# Altium schematic sheet ADS1257.SchDoc
size A4
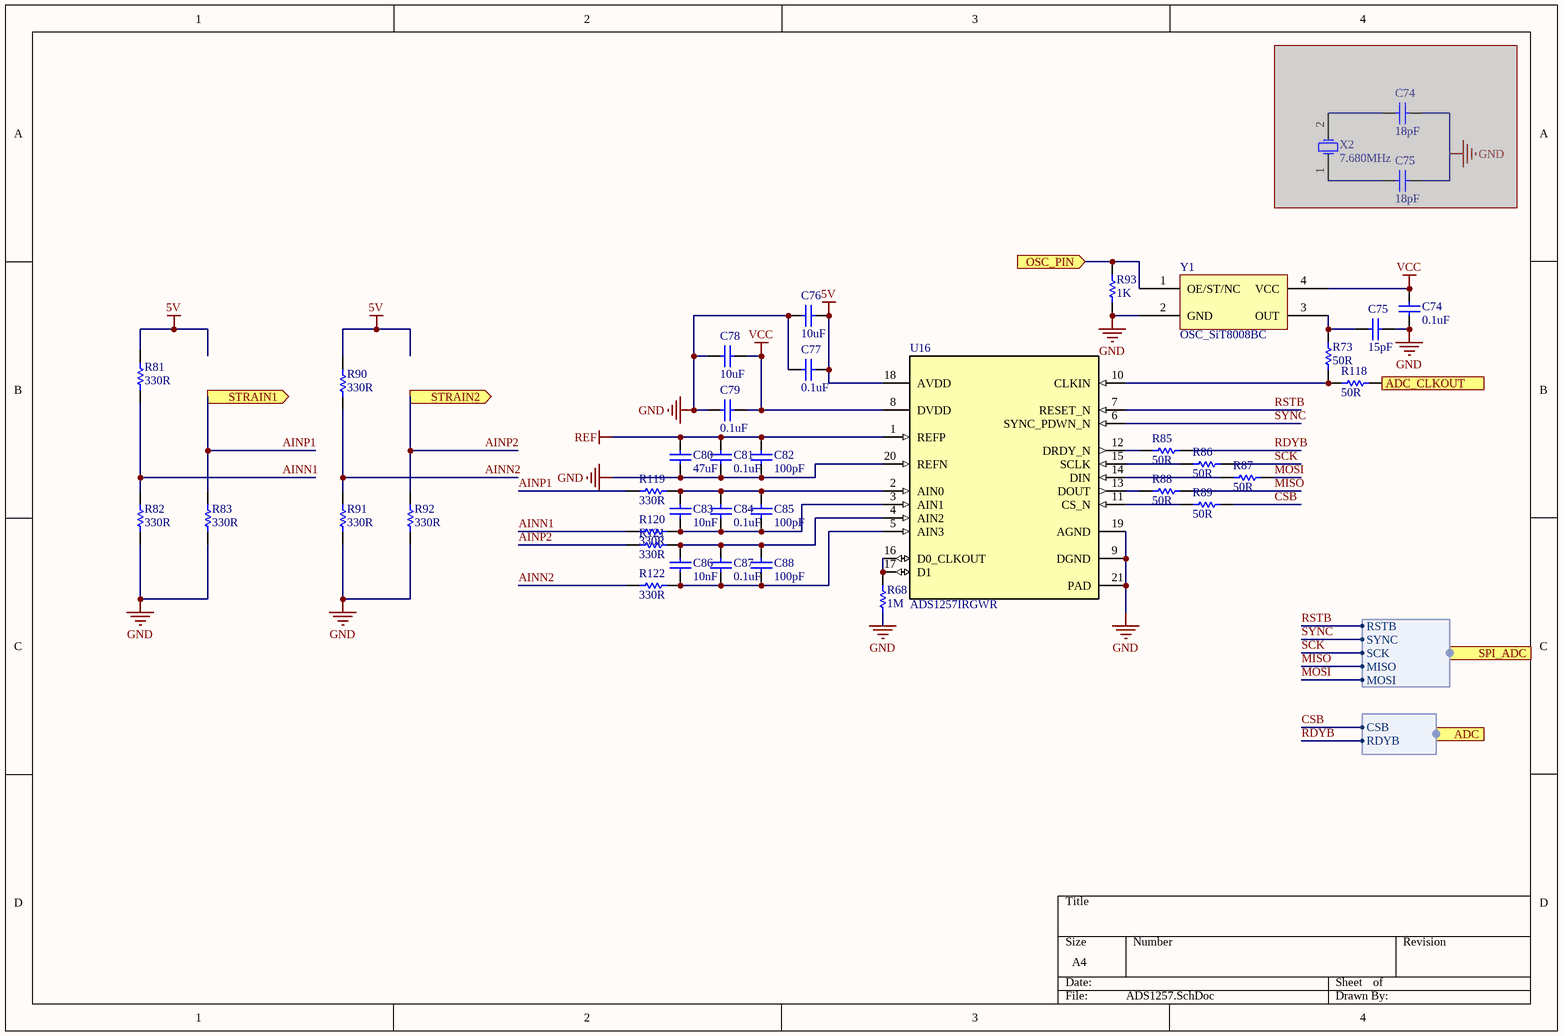
[diagram p0: ADS1257.SchDoc]

## Parts
(Parts that share a designator on the sheet are numbered #1, #2 ... from top to bottom, then left to right.)
C74#1  value 18pF  [C0603[1608X92]]  (hidden comment: 18pF 50V 0603)  (masked out: inside a compile mask, not in the netlist)
C74#2  value 0.1uF  [C0603[1608X92]]  (hidden comment: 0.1uF 16V 0603)
C75#1  value 18pF  [C0603[1608X92]]  (hidden comment: 18pF 50V 0603)  (masked out: inside a compile mask, not in the netlist)
C75#2  value 15pF  [C0603[1608X92]]  (hidden comment: 15pF 50V 0603)
C76  value 10uF  [C0603[1608X92]]  (hidden comment: 10uF 16V 0603)
C77  value 0.1uF  [C0603[1608X92]]  (hidden comment: 0.1uF 16V 0603)
C78  value 10uF  [C0603[1608X92]]  (hidden comment: 10uF 6.3V 0603)
C79  value 0.1uF  [C0603[1608X92]]  (hidden comment: 0.1uF 6.3V 0603)
C80  value 47uF  [C1206[3216X160]]  (hidden comment: 47uF 10V 1206)
C81  value 0.1uF  [C1206[3216X160]]  (hidden comment: 0.1uF 10V 1206)
C82  value 100pF  [C0603[1608X92]]  (hidden comment: 100pF 10V 0603)
C83  value 10nF  [C0805[2012X120]]  (hidden comment: 1uF)
C84  value 0.1uF  [C1206[3216X160]]  (hidden comment: 0.1uF 10V 1206)
C85  value 100pF  [C0603[1608X92]]  (hidden comment: 100pF 10V 0603)
C86  value 10nF  [C0805[2012X120]]  (hidden comment: 1uF)
C87  value 0.1uF  [C1206[3216X160]]  (hidden comment: 0.1uF 10V 1206)
C88  value 100pF  [C0603[1608X92]]  (hidden comment: 100pF 10V 0603)
R68  value 1M  [R0603[1608]]  (hidden comment: 1M 5% 0603)
R73  value 50R  [R0603[1608]]  (hidden comment: 50R 1% 0603)
R81  value 330R  [R0603[1608]]  (hidden comment: 330R 0.1% 0603)
R82  value 330R  [R0603[1608]]  (hidden comment: 330R 0.1% 0603)
R83  value 330R  [R0603[1608]]  (hidden comment: 330R 0.1% 0603)
R85  value 50R  [R0603[1608]]  (hidden comment: 50R 1% 0603)
R86  value 50R  [R0603[1608]]  (hidden comment: 50R 1% 0603)
R87  value 50R  [R0603[1608]]  (hidden comment: 50R 1% 0603)
R88  value 50R  [R0603[1608]]  (hidden comment: 50R 1% 0603)
R89  value 50R  [R0603[1608]]  (hidden comment: 50R 1% 0603)
R90  value 330R  [R0603[1608]]  (hidden comment: 330R 0.1% 0603)
R91  value 330R  [R0603[1608]]  (hidden comment: 330R 0.1% 0603)
R92  value 330R  [R0603[1608]]  (hidden comment: 330R 0.1% 0603)
R93  value 1K  [R0603[1608]]  (hidden comment: 1K 1% 0603)
R118  value 50R  [R0603[1608]]  (hidden comment: 50R 1% 0603)
R119  value 330R  [R0603[1608]]  (hidden comment: 330R 0.1% 0603)
R120  value 330R  [R0603[1608]]  (hidden comment: 330R 0.1% 0603)
R121  value 330R  [R0603[1608]]  (hidden comment: 330R 0.1% 0603)
R122  value 330R  [R0603[1608]]  (hidden comment: 330R 0.1% 0603)
U16  ADS1257IRGWR  [VQFN-20/RGW]
X2  7.680MHz  [OSC_HCN49]  (masked out: inside a compile mask, not in the netlist)
Y1  OSC_SiT8008BC  [OSC_4P_3R2x2R5]

## Ports
ADC (harness ADC), ADC_CLKOUT (in), OSC_PIN (in), SPI_ADC (harness SPI_ADC), STRAIN1 (out), STRAIN2 (out)

## Harnesses
SPI_ADC: MOSI, MISO, SCK, SYNC, RSTB
ADC: CSB, RDYB

## Nets
5V: C76.1 C77.1 R81.2 R90.2 U16.18(AVDD)
GND: C74#2.2 C75#2.1 C76.2 C77.2 C78.2 C79.2 C80.2 C81.2 C82.2 R68.2 R82.1 R83.1 R91.1 R92.1 R93.2 U16.9(DGND) U16.19(AGND) U16.20(REFN) U16.21(PAD) Y1.2(GND)
REF: C80.1 C81.1 C82.1 U16.1(REFP)
VCC: C74#2.1 C78.1 C79.1 U16.8(DVDD) Y1.4(VCC)
ADC_CLKOUT: R118.1 ; port ADC_CLKOUT
AINN1: R81.1 R82.2 R120.2
AINN2: R90.1 R91.2 R122.2
AINP1: R83.2 R119.2 ; port STRAIN1
AINP2: R92.2 R121.2 ; port STRAIN2
CSB: R89.2 ; port ADC.CSB
MISO: R88.2 ; port SPI_ADC.MISO
MOSI: R87.2 ; port SPI_ADC.MOSI
OSC_PIN: R93.1 Y1.1(OE/ST/NC) ; port OSC_PIN
RDYB: R85.2 ; port ADC.RDYB
RSTB: U16.7(RESET_N) ; port SPI_ADC.RSTB
SCK: R86.2 ; port SPI_ADC.SCK
SYNC: U16.6(SYNC_PDWN_N) ; port SPI_ADC.SYNC
NetC75#2_2: C75#2.2 R73.2 Y1.3(OUT)
NetC83_1: C83.1 C84.1 C85.1 R119.1 U16.2(AIN0)
NetC83_2: C83.2 C84.2 C85.2 R120.1 U16.3(AIN1)
NetC86_1: C86.1 C87.1 C88.1 R121.1 U16.4(AIN2)
NetC86_2: C86.2 C87.2 C88.2 R122.1 U16.5(AIN3)
NetR68_1: R68.1 U16.16(D0_CLKOUT) U16.17(D1)
NetR73_1: R73.1 R118.2 U16.10(CLKIN)
NetR85_1: R85.1 U16.12(DRDY_N)
NetR86_1: R86.1 U16.15(SCLK)
NetR87_1: R87.1 U16.14(DIN)
NetR88_1: R88.1 U16.13(DOUT)
NetR89_1: R89.1 U16.11(CS_N)

## Library data of the parts
C74#1 C75#1 = CAP_18pF_50V_0603_1%: 18pF 50V 1% 0603 (1608 Metric); PartNumber: 06035A180FAT2A; Manufacturer: AVX Corporation; TemperatureCoefficient: C0G; Mounting Technology: Surface Mount; PackageReference: 0603; PackageDescription: 0603 (1608 Metric); Voltage: 50V; Tolerance: 1%
C74#2 C77 = CAP_0.1uF_16V_0603_10%: 0.1uF 16V 10% 0603 (1608 Metric); PartNumber: GCM188R71C104KA37D; Manufacturer: Murata; TemperatureCoefficient: X7R; Mounting Technology: Surface Mount; PackageReference: 0603; PackageDescription: 0603 (1608 Metric); Voltage: 16V; Tolerance: 10%
C75#2 = CAP_15pF_50V_0603_1%: 15pF 50V 1% 0603 (1608 Metric); PartNumber: 06035A150FAT2A; Manufacturer: AVX Corporation; TemperatureCoefficient: C0G; Mounting Technology: Surface Mount; PackageReference: 0603; PackageDescription: 0603 (1608 Metric); Voltage: 50V; Tolerance: 1%
C76 = CAP_10uF_16V_0603_10%: 10uF 16V 10% 0603 (1608 Metric); PartNumber: GRM188R61C106KAALD; Manufacturer: Murata; TemperatureCoefficient: X5R; Mounting Technology: Surface Mount; PackageReference: 0603; PackageDescription: 0603 (1608 Metric); Voltage: 16V; Tolerance: 10%
C78 = CAP_10uF_6.3V_0603_10%: 10uF 6.3V 10% 0603 (1608 Metric); PartNumber: GRM188R60J106KE47D; Manufacturer: Murata; TemperatureCoefficient: X5R; Mounting Technology: Surface Mount; PackageReference: 0603; PackageDescription: 0603 (1608 Metric); Voltage: 6.3V; Tolerance: 10%
C79 = CAP_0.1uF_6.3V_0603_10%: 0.1uF 6.3V 10% 0603 (1608 Metric); PartNumber: GRM188R70J104KA01D; Manufacturer: Murata; Mounting Technology: Surface Mount; PackageReference: 0603; PackageDescription: 0603 (1608 Metric); Voltage: 6.3V; Tolerance: 10%
C80 = CAP_47uF_10V_1206_10%: 47uF 10V 10% 1206 (3216 Metric); PartNumber: GRM31CR61A476KE15L; Manufacturer: Murata; Mounting Technology: Surface Mount; PackageReference: 1206; PackageDescription: 1206 (3216 Metric); Voltage: 10V; Tolerance: 10%
C81 C84 C87 = CAP_0.1uF_10V_1206_10%: 0.1uF 10V 10% 1206 (3216 Metric); PartNumber: 885012208009; Manufacturer: Wurth; Mounting Technology: Surface Mount; PackageReference: 1206; PackageDescription: 1206 (3216 Metric); Voltage: 10V; Tolerance: 10%
C82 C85 C88 = CAP_100pF_10V_0603_10%: 100pF 10V 10% 0603 (1608 Metric); PartNumber: 885012206003; Manufacturer: Wurth; TemperatureCoefficient: X7R; Mounting Technology: Surface Mount; PackageReference: 0603; PackageDescription: 0603 (1608 Metric); Voltage: 10V; Tolerance: 10%
C83 C86 = PPS_10nF_16V_0805_2%: PPS_10nF 16V 2% 0805 (2012 metric); Manufacturer: Panasonic; PartNumber: ECH-U1C103GX5; Mounting Technology: Surface Mount; Voltage: 16V; Package Description: 0805 (2012 Metric); Package Reference: 0805; Tolerance: 2%
R68 = RES_1M_0603_5%: 1M 0.25W 5% 0603 (1005 Metric); Manufacturer: Panasonic; PartNumber: ERJ-PA3J105V; Tolerance: 5%; Power: 0.25W; Mounting Technology: Surface Mount; PackageReference: 0603; PackageDescription: 0603 (1608 Metric); ComponentLink1Description: Datasheet; ComponentLink1URL: http://www.vishay.com/docs/20043/crcwhpe3.pdf
R73 R85-R89 R118 = RES_50R_0603_1%: 50R 0.25W 1% 0603 (1005 Metric); Manufacturer: Vishay / Dale; PartNumber: CRCW060349R9FKEAHP; Tolerance: 1%; Power: 0.25W; Mounting Technology: Surface Mount; PackageReference: 0603; PackageDescription: 0603 (1608 Metric); ComponentLink1Description: Datasheet; ComponentLink1URL: http://www.vishay.com/docs/20043/crcwhpe3.pdf
R81-R83 R90-R92 R119-R122 = RES_330R_0603_0.1%: 330R 0.2W 1% 0603 (1005 Metric); Manufacturer: Panasonic; PartNumber: ERJ-PB3B3300V; Tolerance: 0.1%; Power: 0.2W; Mounting Technology: Surface Mount; PackageReference: 0603; PackageDescription: 0603 (1608 Metric); ComponentLink1Description: Datasheet; ComponentLink1URL: http://www.vishay.com/docs/20043/crcwhpe3.pdf
R93 = RES_1K_0603_1%: 1K 0.25W 1% 0603 (1005 Metric); Manufacturer: Vishay / Dale; PartNumber: CRCW06031K00FKEAHP; Tolerance: 1%; Power: 0.25W; Mounting Technology: Surface Mount; PackageReference: 0603; PackageDescription: 0603 (1608 Metric); ComponentLink1Description: Datasheet; ComponentLink1URL: http://www.vishay.com/docs/20043/crcwhpe3.pdf
U16 = ADS1257IRGWR: 24-Bit, 30kSPS, 4-Ch Industrial ADC With Integrated PGA; Manufacturer: Texas Instruments; CompType: IC; PIN_COUNT: 21; Application_BuildNumber: *; PartNumber: ADS1257IRGWR; Alternate_PartNumber: ADS1257IRGW; PackageReference: RGW0020A; MountType: SMT; RefDes: RefDes; TYPE: TYPE; Value: Value
X2 = XTAL_HCM49_7.68MHz: Crystal Oscillator; Manufacturer: Citizen Finedevice Co Ltd; PartNumber: HCM497680000ABJT; Load Capacitance: 18pF; PackageReference: HC-49; Value: 7.680MHz
Y1 = OSC_SiT8008BC: Manufacturer: SiTIME; PartNumber: SiT8008BCT; PackageDescription: 4-SMD